# EAGLE design MA_interface-board (EAGLE 9.4.2)
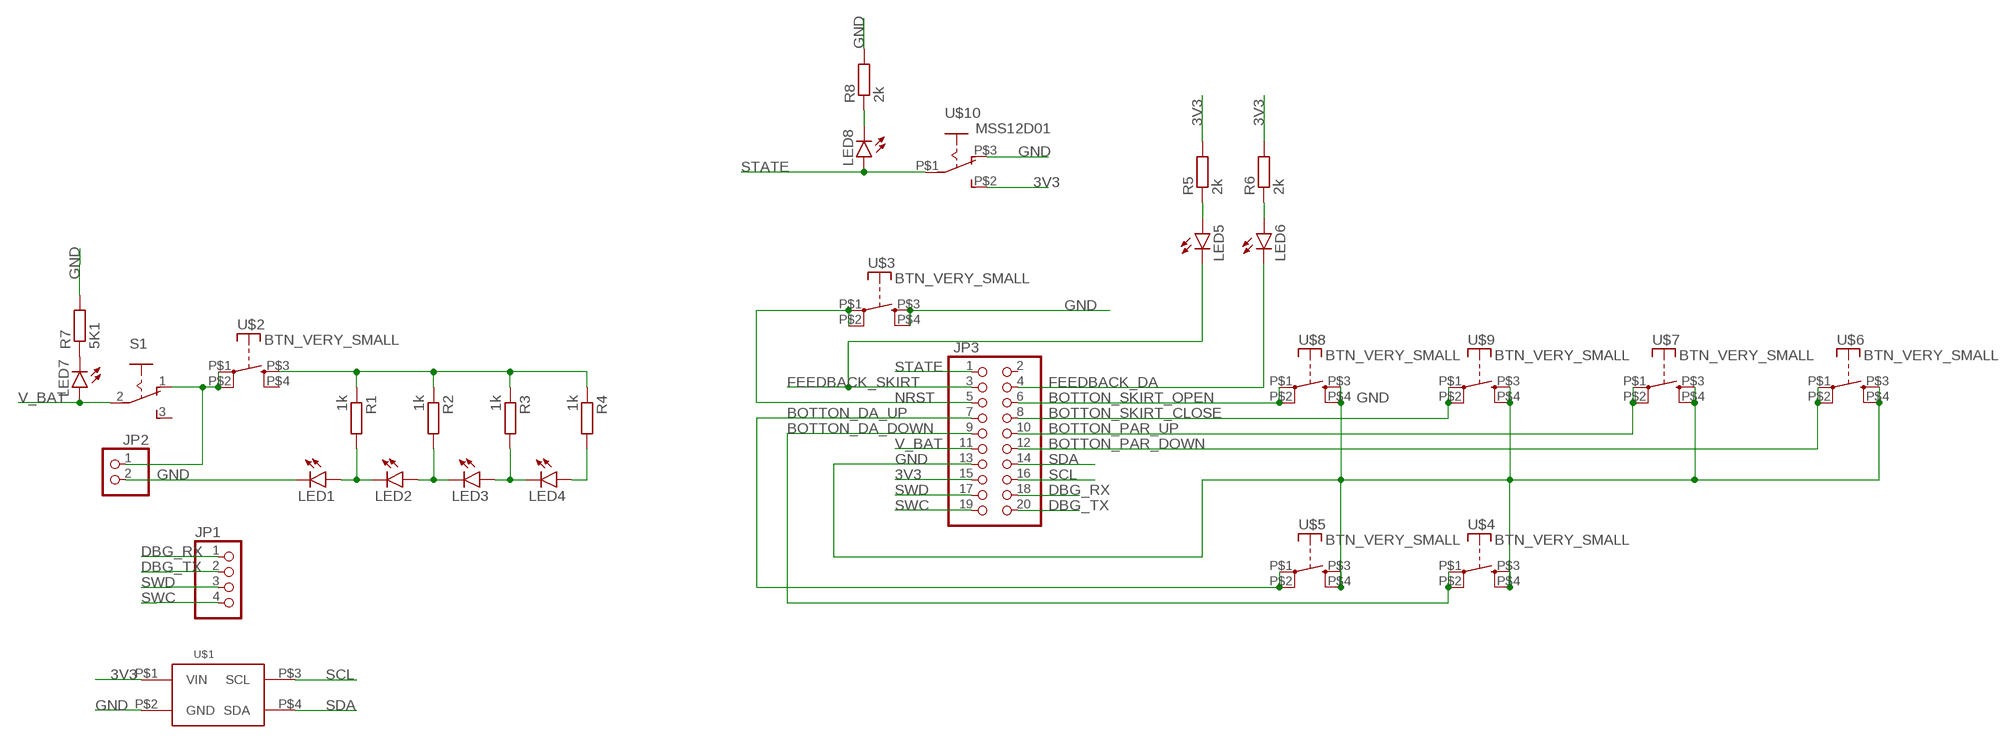
[diagram p0: schematic, sheet 1]

## Parts
JP1  PINHD-1X4  [1X04]
JP2  PINHD-1X2  [1X02]
JP3  PINHD-2X10  [2X10]
LED1  LEDSML0603  [SML0603]
LED2  LEDSML0603  [SML0603]
LED3  LEDSML0603  [SML0603]
LED4  LEDSML0603  [SML0603]
LED5  LEDSML0603  [SML0603]
LED6  LEDSML0603  [SML0603]
LED7  LEDSML0603  [SML0603]
LED8  LEDSML0603  [SML0603]
R1  1k  R-EU_R0603  [R0603]
R2  1k  R-EU_R0603  [R0603]
R3  1k  R-EU_R0603  [R0603]
R4  1k  R-EU_R0603  [R0603]
R5  2k  R-EU_R0603  [R0603]
R6  2k  R-EU_R0603  [R0603]
R7  5K1  R-EU_R0603  [R0603]
R8  2k  R-EU_R0603  [R0603]
S1  UNICS-SWITCH  [UNICS-SWITCH]
U$1  BME280BME280-PINS-ONLY  [BME280-PINS-ONLY]
U$2  BTN_VERY_SMALL  [BTN_VERY_SMALL]
U$3  BTN_VERY_SMALL  [BTN_VERY_SMALL]
U$4  BTN_VERY_SMALL  [BTN_VERY_SMALL]
U$5  BTN_VERY_SMALL  [BTN_VERY_SMALL]
U$6  BTN_VERY_SMALL  [BTN_VERY_SMALL]
U$7  BTN_VERY_SMALL  [BTN_VERY_SMALL]
U$8  BTN_VERY_SMALL  [BTN_VERY_SMALL]
U$9  BTN_VERY_SMALL  [BTN_VERY_SMALL]
U$10  MSS12D01  [MSS12D01]

## Nets
3V3: JP3.15 R5.2 R6.2 U$1.P$1(VIN) U$10.P$2(S)
BOTTON_DA_DOWN: JP3.9 U$4.P$1(P) U$4.P$2(P)
BOTTON_DA_UP: JP3.7 U$5.P$1(P) U$5.P$2(P)
BOTTON_PAR_DOWN: JP3.12 U$6.P$1(P) U$6.P$2(P)
BOTTON_PAR_UP: JP3.10 U$7.P$1(P) U$7.P$2(P)
BOTTON_SKIRT_CLOSE: JP3.8 U$9.P$1(P) U$9.P$2(P)
BOTTON_SKIRT_OPEN: JP3.6 U$8.P$1(P) U$8.P$2(P)
DBG_RX: JP1.1 JP3.18
DBG_TX: JP1.2 JP3.20
FEEDBACK_DA: JP3.4 LED6.C
FEEDBACK_SKIRT: JP3.3 LED5.C
GND: JP2.2 JP3.13 LED1.C R7.2 R8.2 U$1.P$2(GND) U$3.P$3(S) U$3.P$4(S) U$4.P$3(S) U$4.P$4(S) U$5.P$3(S) U$5.P$4(S) U$6.P$3(S) U$6.P$4(S) U$7.P$3(S) U$7.P$4(S) U$8.P$3(S) U$8.P$4(S) U$9.P$3(S) U$9.P$4(S) U$10.P$3(O)
N$1: LED1.A LED2.C R1.2
N$2: LED2.A LED3.C R2.2
N$3: LED3.A LED4.C R3.2
N$4: LED4.A R4.2
N$5: LED7.C R7.1
N$6: JP2.1 S1.1(O) U$2.P$1(P) U$2.P$2(P)
N$7: R1.1 R2.1 R3.1 R4.1 U$2.P$3(S)
N$8: LED5.A R5.1
N$9: LED6.A R6.1
N$10: LED8.C R8.1
NRST: JP3.5 U$3.P$1(P) U$3.P$2(P)
SCL: JP3.16 U$1.P$3(SCL)
SDA: JP3.14 U$1.P$4(SDA)
STATE: JP3.1 LED8.A U$10.P$1(P)
SWC: JP1.4 JP3.19
SWD: JP1.3 JP3.17
V_BAT: JP3.11 LED7.A S1.2(P)
Unconnected: JP3.2 S1.3(S) U$2.P$4(S)

## Library data of the parts
JP1 = pinhead:PINHD-1X4: PIN HEADER
JP2 = pinhead:PINHD-1X2: PIN HEADER
JP3 = pinhead:PINHD-2X10: PIN HEADER
LED1-LED8 = led:LED: LED OSRAM: - CHIPLED LG R971, LG N971, LY N971, LG Q971, LY Q971, LO R971, LY R971 LH N974, LH R974 LS Q976, LO Q976, LY Q976 LO Q996 - Hyper CHIPLED LW Q18S LB Q993, LB Q99A, LB R99A - SideLED LS A670, LO A670, LY A670, LG A670, LP A670 LB A673, LV A673, LT A673, LW A673 LH A674 LY A675 LS A676, LA A676, LO A676, LY A676, LW A676 LS A679, LY A679, LG A679 - Hyper Micro SIDELED® LS Y876, LA Y876, LO Y876, LY Y876 LT Y87S - SmartLED LW L88C, LW L88S LB L89C, LB L89S, LG L890 LS L89K, LO L89K, LY L89K LS L896, LA L896, LO L896, LY L896 - TOPLED LS T670, LO T670, LY T670, LG T670, LP T670 LSG T670, LSP T670, LSY T670, LOP T670, LYG T670 LG T671, LOG T671, LSG T671 LB T673, LV T673, LT T673, LW T673 LH T674 LS T676, LA T676, LO T676, LY T676, LB T676, LH T676, LSB T676, LW T676 LB T67C, LV T67C, LT T67C, LS T67K, LO T67K, LY T67K, LW E67C LS E67B, LA E67B, LO E67B, LY E67B, LB E67C, LV E67C, LT E67C LW T67C LS T679, LY T679, LG T679 LS T770, LO T770, LY T770, LG T770, LP T770 LB T773, LV T773, LT T773, LW T773 LH T774 LS E675, LA E675, LY E675, LS T675 LS T776, LA T776, LO T776, LY T776, LB T776 LHGB T686 LT T68C, LB T68C - Hyper Mini TOPLED® LB M676 - Mini TOPLED Santana® LG M470 LS M47K, LO M47K, LY M47K Source: http://www.osram.convergy.de LUXEON: - LUMILED® LXK2-PW12-R00, LXK2-PW12-S00, LXK2-PW14-U00, LXK2-PW14-V00 LXK2-PM12-R00, LXK2-PM12-S00, LXK2-PM14-U00 LXK2-PE12-Q00, LXK2-PE12-R00, LXK2-PE12-S00, LXK2-PE14-T00, LXK2-PE14-U00 LXK2-PB12-K00, LXK2-PB12-L00, LXK2-PB12-M00, LXK2-PB14-N00, LXK2-PB14-P00, LXK2-PB14-Q00 LXK2-PR12-L00, LXK2-PR12-M00, LXK2-PR14-Q00, LXK2-PR14-R00 LXK2-PD12-Q00, LXK2-PD12-R00, LXK2-PD12-S00 LXK2-PH12-R00, LXK2-PH12-S00 LXK2-PL12-P00, LXK2-PL12-Q00, LXK2-PL12-R00 Source: www.luxeon.com KINGBRIGHT: KA-3528ASYC Source: www.kingbright.com
R1-R8 = rcl:R-EU_: RESISTOR, European symbol; SPICEPREFIX: R
S1 = cansat-lib:UNICS-SWITCH: SLIDING SWITCH Distributor Buerklin, 11G810
U$1 = NEON-BLADE-2023:BME280
U$2-U$9 = NEON-BLADE-2023:BTN_VERY_SMALL
U$10 = NEON-BLADE-2023:MSS12D01

## Board
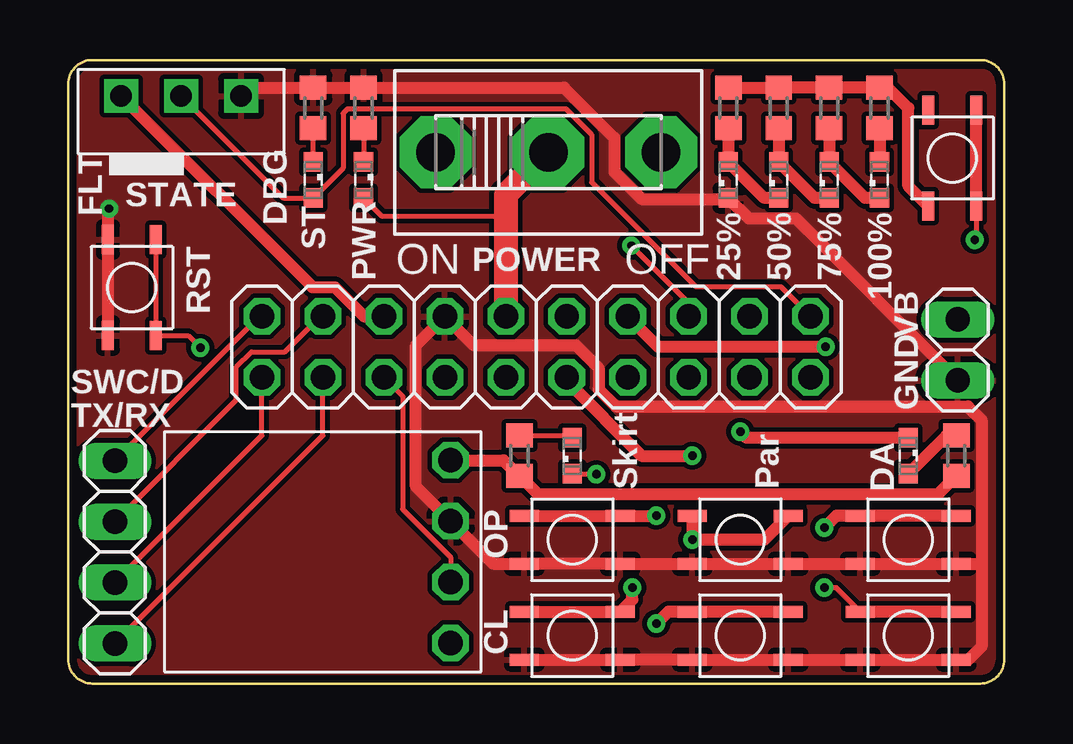
[diagram p1: board, top side]
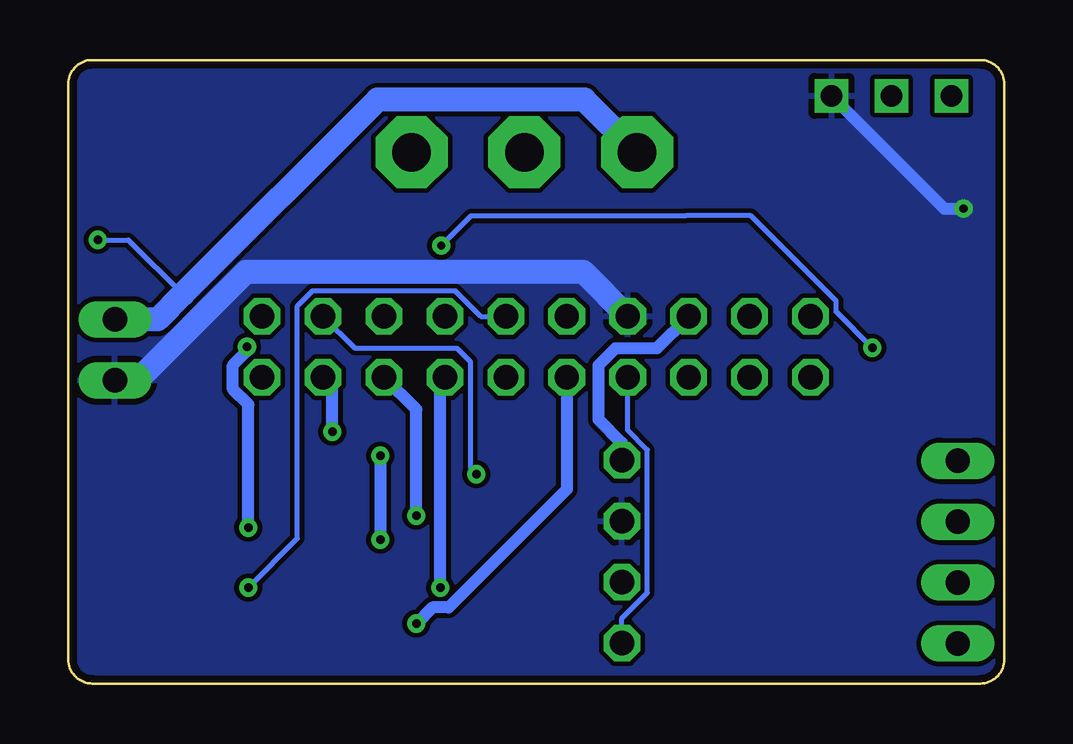
[diagram p2: board, bottom side, seen from below]

Size 39 x 26 mm. Coordinates in mm from the lower left corner, seen from the top.
Outline: 0,1 0,25 arc-90 1,26 38,26 arc-90 39,25 39,1 arc-90 38,0 1,0 arc-90 0,1
Copper layers (1*16): Top 0.035mm / dielectric 1.5mm / Bottom 0.035mm
Design rules "default *": minimum track width 0.2mm, minimum drill 0.35mm, track to track 0.2mm, track to pad 0.2mm, pad to pad 0.2mm, via to via 0.2mm, smd to smd 0.2mm, copper to edge 0.3mm, drill to drill 6mil, minimum pad ring 10mil, minimum via ring 8mil, stop-mask expansion 4mil, vias tented up to drill 0mil, thermal gap 10mil

### Footprints (pad centres in the part's own frame; a part is rotated, then mirrored left to right if it is on the bottom)
1X04 = drill 1.016 long: 1 -3.81,0; 2 -1.27,0; 3 1.27,0; 4 3.81,0
1X02 = drill 1.016 long: 1 -1.27,0; 2 1.27,0
2X10 = drill 1.016 octagon: 1 -11.43,-1.27; 2 -11.43,1.27; 3 -8.89,-1.27; 4 -8.89,1.27; 5 -6.35,-1.27; 6 -6.35,1.27; 7 -3.81,-1.27; 8 -3.81,1.27; 9 -1.27,-1.27; 10 -1.27,1.27; 11 1.27,-1.27; 12 1.27,1.27; 13 3.81,-1.27; 14 3.81,1.27; 15 6.35,-1.27; 16 6.35,1.27; 17 8.89,-1.27; 18 8.89,1.27; 19 11.43,-1.27; 20 11.43,1.27
SML0603 = smd 0.8 x 0.8: A 0.75,0; C -0.75,0
R0603 = smd 1 x 1.1: 1 -0.85,0; 2 0.85,0
UNICS-SWITCH = drill 1.6 pad 3 octagon: 1 -4.7,0; 2 0,0; 3 4.7,0
BME280-PINS-ONLY = drill 1.016 octagon: P$1 -3.81,5.33; P$2 -1.27,5.33; P$3 1.27,5.33; P$4 3.81,5.33
BTN_VERY_SMALL = smd 1.2 x 0.5: P$1 -2,1; P$2 2,1; P$3 2,-1; P$4 -2,-1
MSS12D01 = drill 0.9 square: P$1 0,0; P$2 2.5,0; P$3 -2.5,0

### Placement (x,y rotation side)
JP1  1.94,5.48 90 top
JP2  37.06,13.91 270 top
JP3  19.5,14.04 180 top
LED1  27.5,21 90 top
LED2  29.6,21 90 top
LED3  31.7,21 90 top
LED4  33.8,21 90 top
LED5  21,9.5 90 top
LED6  35,9.5 270 top
LED7  12.3,21 270 top
LED8  10.2,21 270 top
R1  27.5,24 270 top
R2  29.6,24 270 top
R3  31.7,24 270 top
R4  33.8,24 270 top
R5  18.8,9.5 270 top
R6  37,9.5 270 top
R7  12.3,24 90 top
R8  10.2,24 90 top
S1  20,22.15 0 top
U$1  10.6,5.5 270 top
U$2  36.84,21.91 270 top
U$3  2.65,16.51 270 top
U$4  35,2 0 top
U$5  35,6 0 top
U$6  28,2 0 top
U$7  28,6 0 top
U$8  21,6 0 top
U$9  21,2 0 top
U$10  4.7,24.5 180 top

### Tracks (layer width: path | path; a pad name or v marks a point on that pad's centre or on a via)
3V3
  Top 0.5: U$10.P$2 10.18,16.52 11.11,16.52 12.32,15.31 JP3.15 | U$1.P$1 18.14,9.31 R5.2 19.55,7.9 35.59,7.9 36.25,7.9 R6.2
  Bottom 0.5: U$1.P$1 15.93,10.03 16.9,11.01 16.9,13.27 16.19,13.98 14.48,13.98 JP3.15
BOTTON_DA_DOWN  (via drill 0.35)
  Top 0.2: U$4.P$1 32,4 v31.5,4
  Top 0.5: U$4.P$2 U$4.P$1
  Bottom 0.2: v31.5,4 29.45,6.05 29.45,15.75 28.83,16.37 22.87,16.37 21.81,15.31 JP3.9
BOTTON_DA_UP  (via drill 0.35)
  Top 0.5: U$5.P$2 U$5.P$1 32,7 v31.5,6.5 | v31.55,14.04 24.58,14.04 JP3.7
  Bottom 0.5: v31.55,14.04 31.55,13.86 32.14,13.27 32.14,12.27 31.5,11.63 v31.5,6.5
BOTTON_PAR_DOWN  (via drill 0.35)
  Top 0.5: U$6.P$2 U$6.P$1 25,3 v24.5,2.5
  Bottom 0.5: v24.5,2.5 23.83,3.17 23.16,3.17 18.23,8.1 JP3.12
BOTTON_PAR_UP  (via drill 0.35)
  Top 0.5: U$7.P$2 29,6 v26,6 U$7.P$1 | v26,9.5 23.88,9.5 20.77,12.61 JP3.10
  Bottom 0.5: v26,9.5 v26,6
BOTTON_SKIRT_CLOSE  (via drill 0.35)
  Top 0.5: U$9.P$1 U$9.P$2 23.5,3.5 v23.5,4
  Bottom 0.5: v23.5,4 23.5,12.58 JP3.8
BOTTON_SKIRT_OPEN  (via drill 0.35)
  Top 0.5: v24.5,7 U$8.P$2 U$8.P$1
  Bottom 0.5: v24.5,7 24.5,11.42 JP3.6
DBG_RX
  Top 0.2: JP1.1 10.61,10.34 JP3.18
DBG_TX
  Top 0.2: JP1.2 8.07,10.34 JP3.20
FEEDBACK_DA  (via drill 0.35)
  Top 0.5: LED6.C 28.25,10.25 v28,10.5
  Bottom 0.5: v28,10.5 28,12.38 JP3.4
FEEDBACK_SKIRT  (via drill 0.35)
  Top 0.2: v22,8.73 21.02,8.73 LED5.C
  Bottom 0.2: JP3.3 27.06,13.98 22.81,13.98 22.25,13.42 22.25,8.98 v22,8.73
GND  (via drill 0.35)
  Top 0.5: 38.05,5 38.05,10.99 37.48,11.56 22.81,11.56 22.1,12.27 22.1,13.16 21.16,14.1 16.9,14.1 JP3.13 14.48,14.1 14.48,8.22 U$1.P$2 17.7,5 U$8.P$4 U$8.P$3 U$7.P$4 U$7.P$3 U$5.P$4 U$5.P$3 38.05,5 | U$9.P$4 U$9.P$3 U$6.P$4 U$6.P$3 U$4.P$4 U$4.P$3 37.5,1 38.05,1.55 38.05,5 | U$10.P$3 7.55,24.85 R8.2 R7.2 20.65,24.85 22.75,22.75 22.75,21.34 23.89,20.2 27.45,20.2 LED1.C 28.35,19.4 30.3,19.4 JP2.2 | v1.7,19.8 1.65,19.75 U$3.P$4 U$3.P$3
  Bottom 0.5: U$10.P$3 2.5,19.8 v1.7,19.8
  Bottom 1: JP2.2 36.12,12.64 31.59,17.17 17.55,17.17 JP3.13
  pour Top: -1,28 41.5,28 41.5,-2 -1,-2
  pour Bottom: -1.5,28.5 42,28.5 42,-2.5 -1.5,-2.5
N$1
  Top 0.5: R1.2 LED1.A 29,20.25 LED2.C
N$2
  Top 0.5: R2.2 LED2.A 31.1,20.25 LED3.C
N$3
  Top 0.5: R3.2 LED3.A 33.2,20.25 LED4.C
N$4
  Top 0.5: R4.2 LED4.A
N$5
  Top 0.2: R7.1 LED7.C
N$6  (via drill 0.35)
  Top 0.2: U$2.P$2 37.84,18.57 v37.77,18.5
  Top 0.5: U$2.P$2 U$2.P$1
  Bottom 0.2: v37.77,18.5 36.5,18.5 34.23,16.23
  Bottom 1: S1.1 17.5,24.35 26.11,24.35 34.23,16.23 35.28,15.18 JP2.1
N$7
  Top 0.5: U$2.P$3 35,20.75 35,24 34.15,24.85 R4.1 R3.1 R2.1 R1.1
N$8
  Top 0.2: R5.1 20.9,10.35 LED5.A
N$9
  Top 0.5: LED6.A 36.6,10.35 R6.1
N$10
  Top 0.2: LED8.C R8.1
NRST  (via drill 0.35)
  Top 0.2: U$3.P$1 U$3.P$2 4.99,14.51 v5.5,14 | v23.46,18.26 25.85,15.87 JP3.5
  Bottom 0.2: v5.5,14 7.01,15.51 7.01,15.96 10.56,19.51 13.28,19.51 13.29,19.5 22.22,19.5 v23.46,18.26
SCL
  Top 0.2: JP3.16 13.93,11.99 13.93,7.27 15.93,5.27 U$1.P$3
SDA
  Bottom 0.2: U$1.P$4 15.93,2.73 14.87,3.79 14.87,9.75 15.69,10.57 JP3.14
STATE
  Top 0.2: U$10.P$1 8.95,20.25 LED8.A 11.45,21.5 11.45,23.77 11.63,23.95 20.75,23.95 21.8,22.9 21.8,20.9 26.15,16.55 29.69,16.55 JP3.1
SWC
  Top 0.2: JP1.4 7.96,15.31 JP3.19
SWD
  Top 0.2: JP3.17 10.5,15.31 9.02,13.83 7.63,13.83 7.01,13.21 7.01,11.82 JP1.3
V_BAT
  Top 0.2: LED7.A 13.05,19.5 18.23,19.5
  Top 1: S1.2 18.23,20.38 18.23,19.5 JP3.11

### Text on the board
tPlace: FLT | DBG | STATE | ST | PWR | POWER | 25% | 50% | 75% | 100% | RST | VB | SWC/D | TX/RX | GND | Skirt | Par | DA | OP | CL